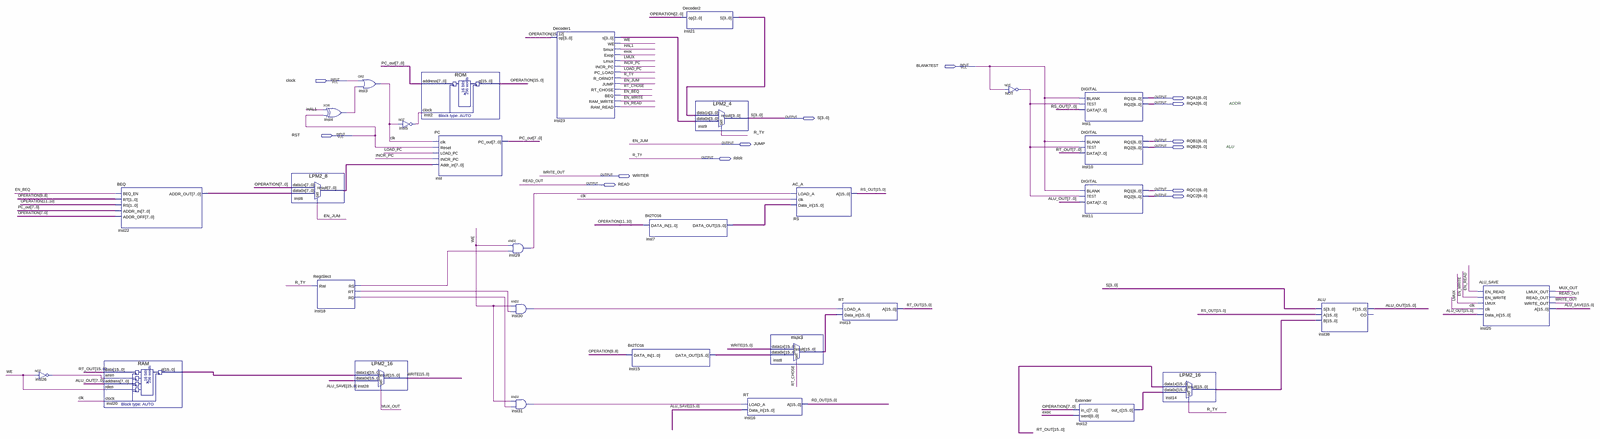
[diagram p0: schematic sheet, whole]
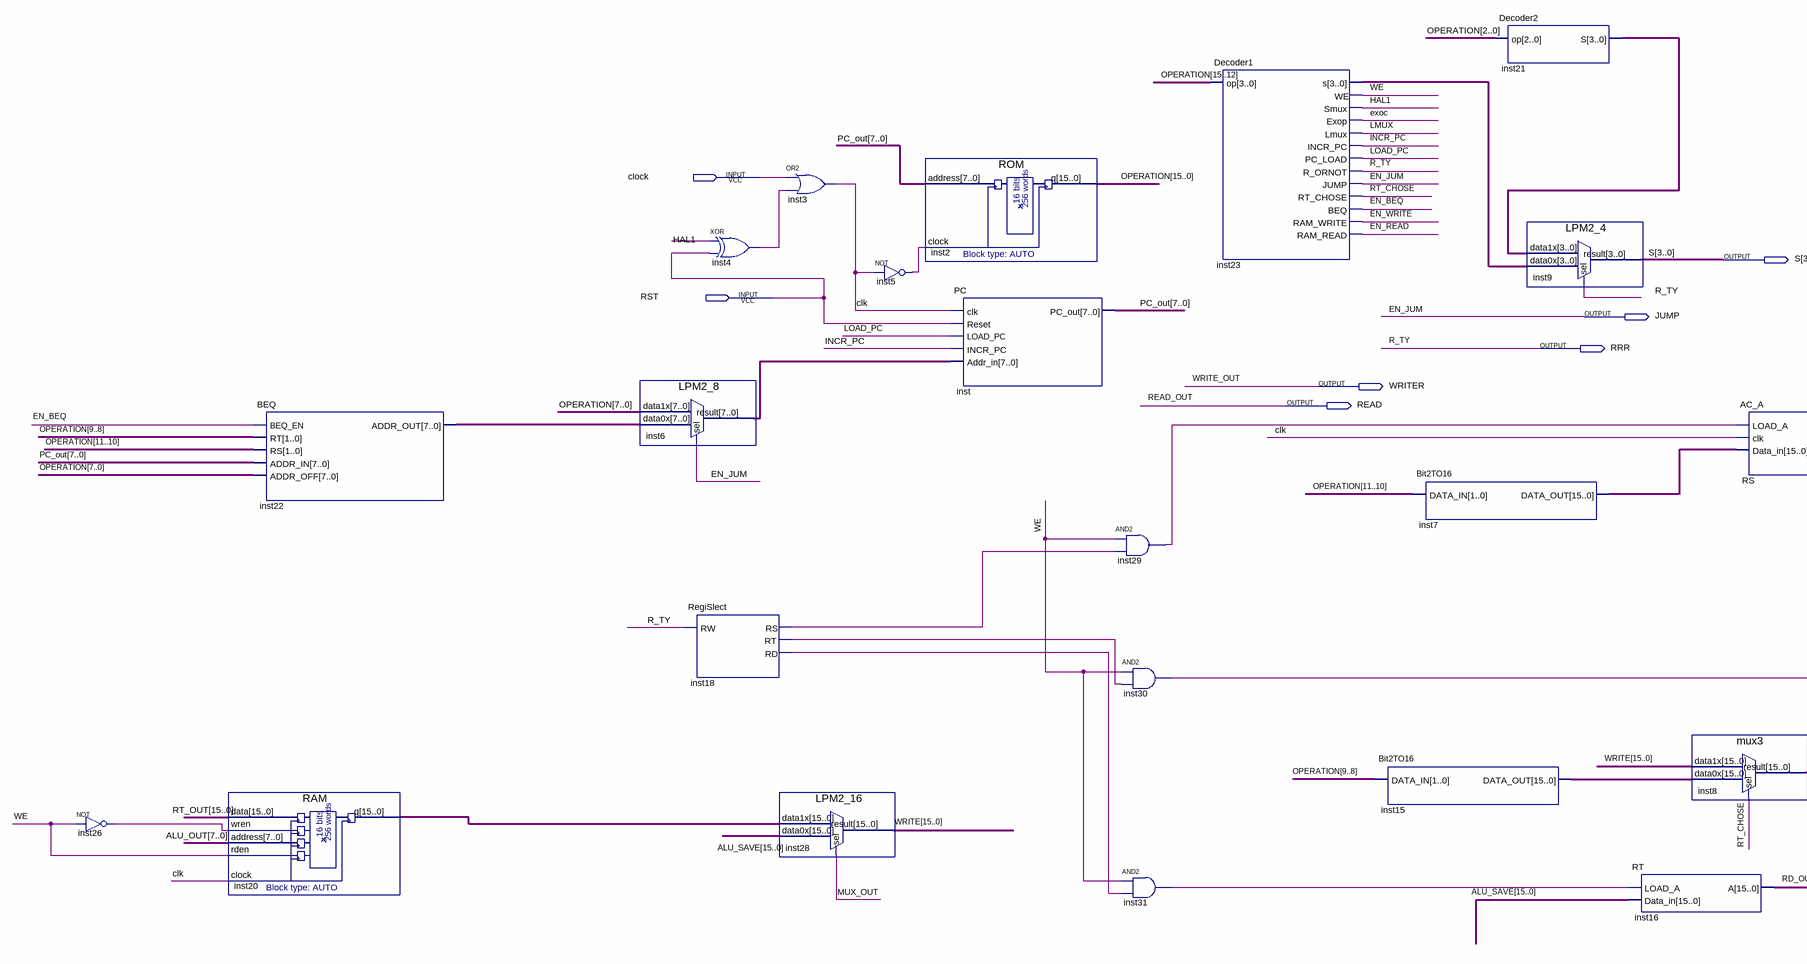
[diagram p1: schematic sheet, left part]
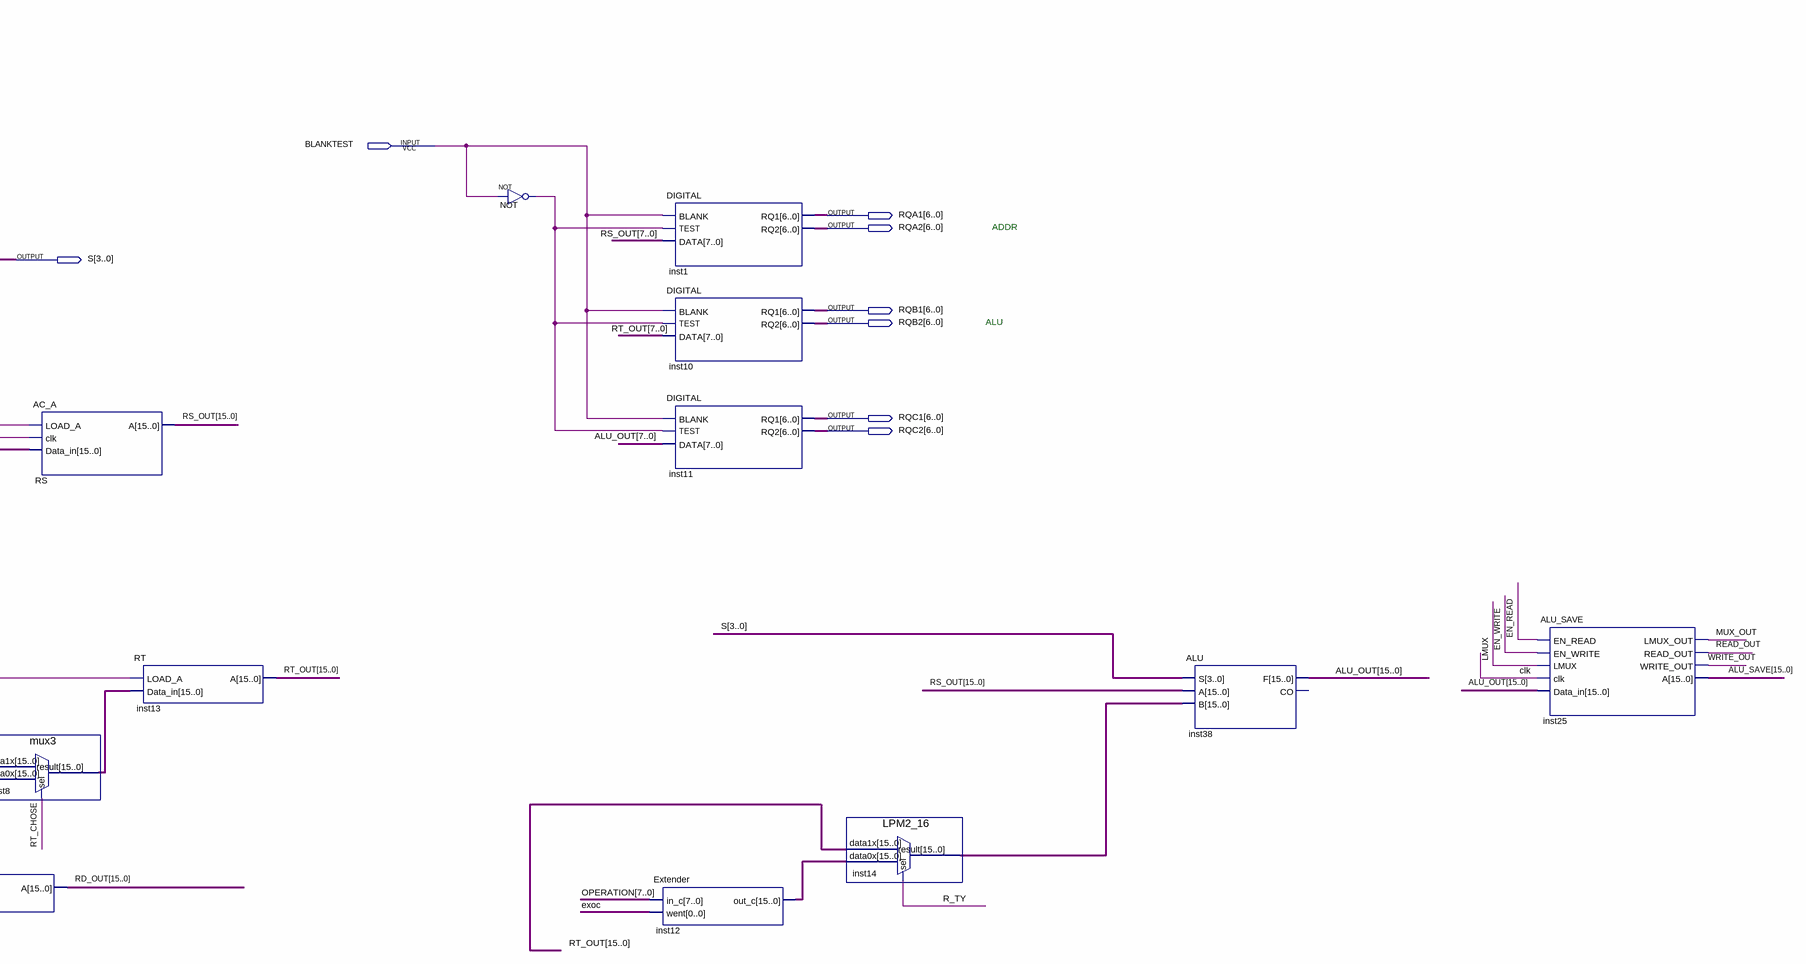
[diagram p2: schematic sheet, right part]
// Quartus schematic CPU.bdf as structural Verilog: 31 symbols, 14 pins
module CPU (
  input  BLANKTEST,
  input  clock,
  input  RST,
  output [6:0] RQA1,
  output [6:0] RQA2,
  output [3:0] S,
  output [6:0] RQB1,
  output JUMP,
  output [6:0] RQB2,
  output RRR,
  output WRITER,
  output READ,
  output [6:0] RQC1,
  output [6:0] RQC2
);

  wire clk, EN_BEQ, EN_READ, EN_WRITE, exoc, HAL1, INCR_PC, inst4_out, inst5_out, inst18_rd, inst18_rs,
       inst18_rt, inst26_out, inst29_out, inst30_out, inst31_out, LMUX, LOAD_PC, MUX_OUT, NOT_out, RT_CHOSE,
       WE;
  wire [3:0] inst21_s, inst23_s;
  wire [7:0] inst6_result, inst22_addr_out, PC_out;
  wire [15:0] ALU_OUT, ALU_SAVE, inst7_data_out, inst8_result, inst12_out_c, inst14_result, inst15_data_out,
       inst20_q, OPERATION, RD_OUT, RS_OUT, RT_OUT, WRITE;

  not inst26 (inst26_out, WE);
  RAM inst20 (.data(RT_OUT), .wren(inst26_out), .address(ALU_OUT[7:0]), .rden(WE), .clock(clk), .q(inst20_q));
  BEQ inst22 (
    .BEQ_EN(EN_BEQ), .RT(OPERATION[9:8]), .RS(OPERATION[11:10]), .ADDR_IN(PC_out), .ADDR_OFF(OPERATION[7:0]),
    .ADDR_OUT(inst22_addr_out));
  LPM2_8 inst6 (.data1x(OPERATION[7:0]), .data0x(inst22_addr_out), .sel(JUMP), .result(inst6_result));
  RegiSlect inst18 (.RW(RRR), .RS(inst18_rs), .RT(inst18_rt), .RD(inst18_rd));
  xor inst4 (inst4_out, HAL1, RST);
  or inst3 (clk, clock, inst4_out);
  LPM2_16 inst28 (.data1x(inst20_q), .data0x(ALU_SAVE), .sel(MUX_OUT), .result(WRITE));
  not inst5 (inst5_out, clk);
  ROM inst2 (.address(PC_out), .clock(inst5_out), .q(OPERATION));
  PC inst (.clk(clk), .Reset(RST), .LOAD_PC(LOAD_PC), .INCR_PC(INCR_PC), .Addr_in(inst6_result), .PC_out(PC_out));
  and inst29 (inst29_out, WE, inst18_rs);
  and inst30 (inst30_out, WE, inst18_rt);
  and inst31 (inst31_out, WE, inst18_rd);
  Decoder1 inst23 (
    .op(OPERATION[15:12]), .s(inst23_s), .WE(WE), .Smux(HAL1), .Exop(exoc), .Lmux(LMUX), .INCR_PC(INCR_PC),
    .PC_LOAD(LOAD_PC), .R_ORNOT(RRR), .JUMP(JUMP), .RT_CHOSE(RT_CHOSE), .BEQ(EN_BEQ), .RAM_WRITE(EN_WRITE),
    .RAM_READ(EN_READ));
  Bit2TO16 inst15 (.DATA_IN(OPERATION[9:8]), .DATA_OUT(inst15_data_out));
  Bit2TO16 inst7 (.DATA_IN(OPERATION[11:10]), .DATA_OUT(inst7_data_out));
  Decoder2 inst21 (.op(OPERATION[2:0]), .S(inst21_s));
  LPM2_4 inst9 (.data1x(inst21_s), .data0x(inst23_s), .sel(RRR), .result(S));
  RT inst16 (.LOAD_A(inst31_out), .Data_in(ALU_SAVE), .A(RD_OUT));
  mux3 inst8 (.data1x(WRITE), .data0x(inst15_data_out), .sel(RT_CHOSE), .result(inst8_result));
  AC_A RS (.LOAD_A(inst29_out), .clk(clk), .Data_in(inst7_data_out), .A(RS_OUT));
  RT inst13 (.LOAD_A(inst30_out), .Data_in(inst8_result), .A(RT_OUT));
  not NOT (NOT_out, BLANKTEST);
  DIGITAL inst1 (.BLANK(BLANKTEST), .TEST(NOT_out), .DATA(RS_OUT[7:0]), .RQ1(RQA1), .RQ2(RQA2));
  DIGITAL inst10 (.BLANK(BLANKTEST), .TEST(NOT_out), .DATA(RT_OUT[7:0]), .RQ1(RQB1), .RQ2(RQB2));
  DIGITAL inst11 (.BLANK(BLANKTEST), .TEST(NOT_out), .DATA(ALU_OUT[7:0]), .RQ1(RQC1), .RQ2(RQC2));
  Extender inst12 (.in_c(OPERATION[7:0]), .went(exoc), .out_c(inst12_out_c));
  LPM2_16 inst14 (.data1x(RT_OUT), .data0x(inst12_out_c), .sel(RRR), .result(inst14_result));
  ALU inst38 (.S(S), .A(RS_OUT), .B(inst14_result), .F(ALU_OUT));  // open: CO
  ALU_SAVE inst25 (
    .EN_READ(EN_READ), .EN_WRITE(EN_WRITE), .LMUX(LMUX), .clk(clk), .Data_in(ALU_OUT), .LMUX_OUT(MUX_OUT),
    .READ_OUT(READ), .WRITE_OUT(WRITER), .A(ALU_SAVE));

  // Other names for the same wires on the sheet: EN_JUM = JUMP; R_TY = RRR; READ_OUT = READ; WRITE_OUT = WRITER

  // Notes on the sheet:
  //   ADDR
  //   ALU
endmodule
